# EasyEDA schematic EtapaDeControl.json
TITLE: Circuito de Control del Amplificador; REV: 1.0; Date: 2023-03-07; Sheet: 1/1; Company: UTP
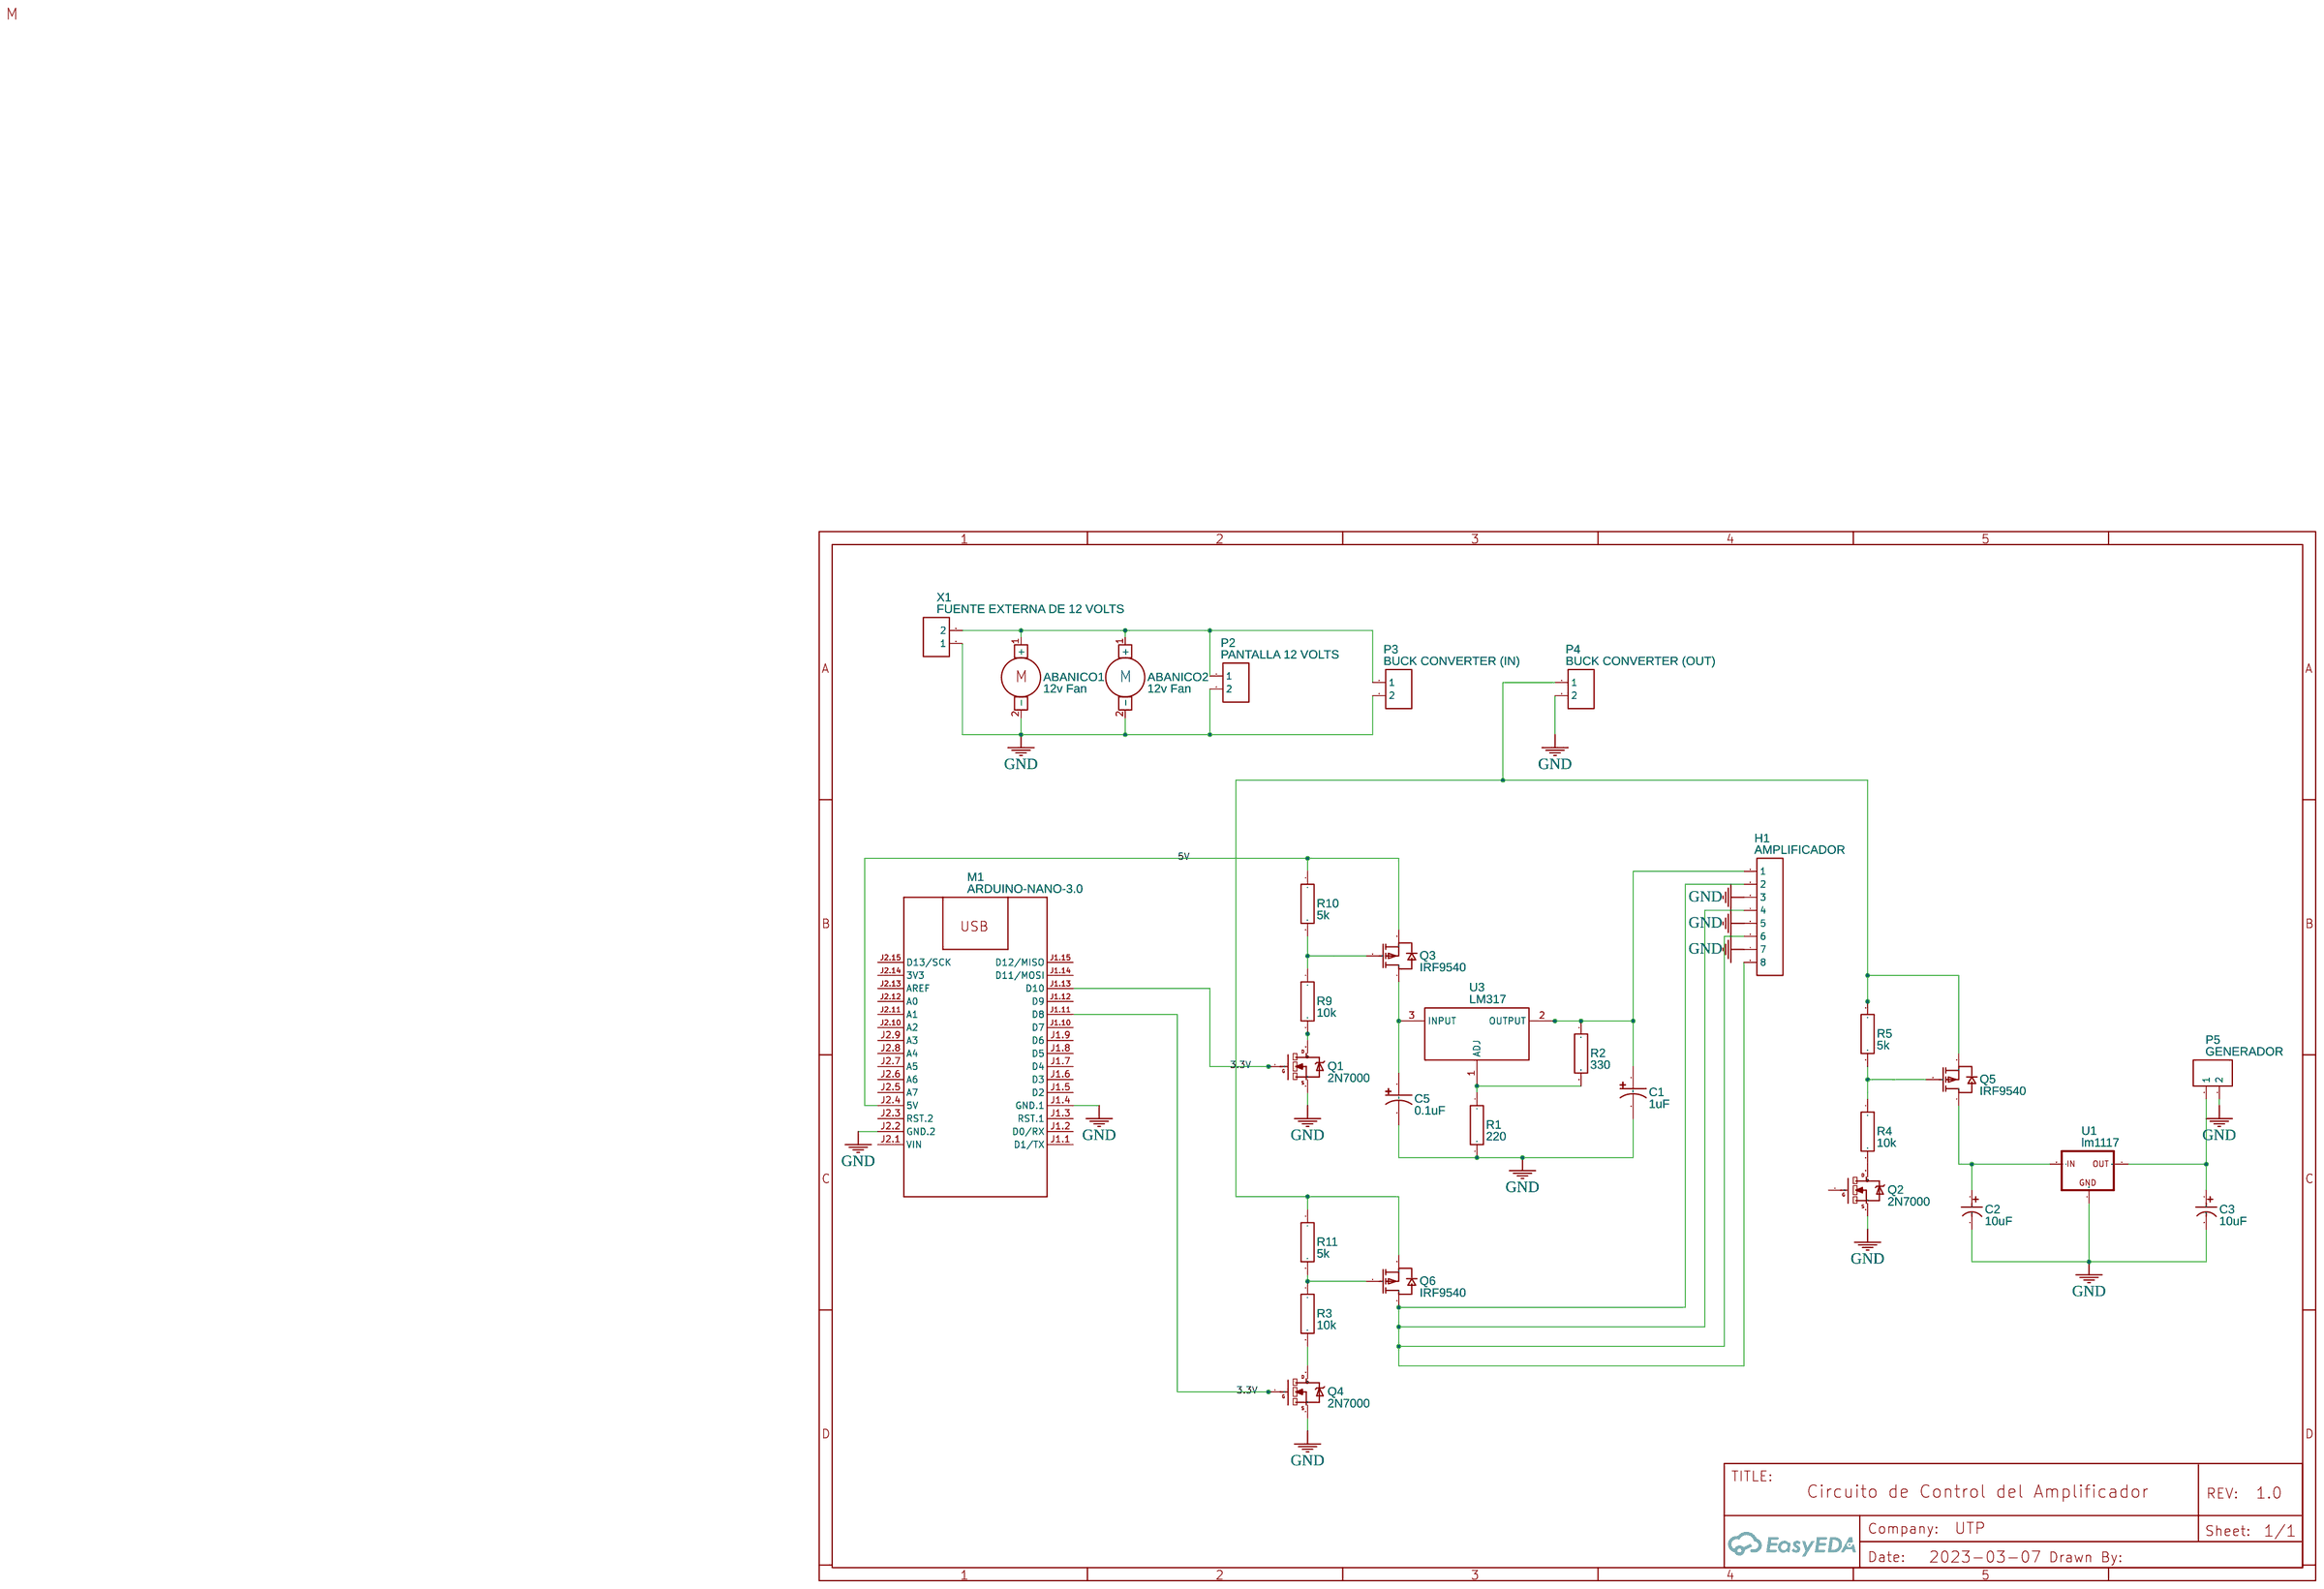
[diagram p0: schematic sheet]

## Parts
ABANICO1  12v Fan  [DC FAN]
ABANICO2  12v Fan  [DC FAN]
C1  1uF  [CAP-SMD_L3.2-W1.6]
C2  10uF  [CAP-SMD_BD4.0-L4.3-W4.3-FD]
C3  10uF  [CAP-SMD_BD4.0-L4.3-W4.3-FD]
C5  0.1uF  [CAP-SMD_L3.2-W1.6]
H1  AMPLIFICADOR  [HDR-F-2.54_1X8]
M1  ARDUINO-NANO-3.0  [ARDUINO-NANO-3.0]
P2  PANTALLA 12 VOLTS  [CONN-TH_2P-P5.00]
P3  BUCK CONVERTER (IN)  [CONN-TH_2P-P5.00]
P4  BUCK CONVERTER (OUT)  [CONN-TH_2P-P5.00]
P5  GENERADOR  [CONN-TH_2P-P5.00]
Q1  2N7000  [SOT23-3]
Q2  2N7000  [SOT23-3]
Q3  IRF9540  [TO-263-2_L10.0-W9.1-P5.08-LS15.2-BR]
Q4  2N7000  [SOT23-3]
Q5  IRF9540  [TO-263-2_L10.0-W9.1-P5.08-LS15.2-BR]
Q6  IRF9540  [TO-263-2_L10.0-W9.1-P5.08-LS15.2-BR]
R1  220  [RESISTOR-SMD]
R2  330  [RESISTOR-SMD]
R3  10k  [RESISTOR-SMD]
R4  10k  [RESISTOR-SMD]
R5  5k  [RESISTOR-SMD]
R9  10k  [RESISTOR-SMD]
R10  5k  [RESISTOR-SMD]
R11  5k  [RESISTOR-SMD]
U1  lm1117  [LM1117]
U3  LM317  [LM317DCY.]
X1  FUENTE EXTERNA DE 12 VOLTS  [CONN-TH_2P-P5.00]

## Library data of the parts
ABANICO1 ABANICO2 = 12v Fan: Contributor: kudgar
C1 C5 = 267M1602105KRA: Supplier: LCSC; Supplier Part: C231303; Manufacturer: Matsuo(松尾电机); Contributor: LCSC; JLCPCB Part Class: Extended Part
C2 C3 = 10UF: Supplier: LCSC; Supplier Part: C249759; Manufacturer: Lelon; Manufacturer Part: VEZ100M1E0405-TRO; Contributor: LCSC; LCSC Assembly: Yes; SMT Type: Extend
H1 = HDR-F-2.54_1x8: Supplier Part: C225505; Supplier: LCSC; Contributor: LCEDA_Lib
M1 = ARDUINO-NANO-3.0: Contributor: Tomasz Kuczyński
P2-P5 X1 = CONN-TH_2P-P5.00: Supplier: LCSC; Contributor: LCEDA_Lib
Q1 Q2 Q4 = MOSFET-NCHANNELSMD: Contributor: Arpit Pradhan
Q3 Q5 Q6 = IRF5210: Supplier: LCSC; Manufacturer: IR; image: //image.lceda.cn/szlcsc/C2622.jpg; Supplier Part: C2622; Paste Type: expand; Contributor: rahul8055
R1-R5 R9-R11 = 1,2k: Contributor: Vitaliy_Drozd
U1 = lm1117: Contributor: kleverfp
U3 = LM317: Manufacturer Part: Texas Instrument; Supplier Part: 296-23224-5-ND; Supplier: Digi-Key; link: https://easyeda.com/editor#id=364e3999b0554c309ff692a89169b61a|e1049ebff7364203986d8eded41812b1|_1ec5c8fb364145d695f32fca63cc5327|_3473fdf19c2c43b69786d7e4cec8776c|_ebef7e5d3f5b45b5b4bbfe52d2b3ed92|_78304fab4b104d07a1b98938696b1d68; Contributor: jopasmacarubbo

## Nets
3.3V: M1.J1.11(D8) M1.J1.13(D10) Q1.1(G) Q4.1(G)
5V: M1.J2.4(5V) Q3.3(S) R10.1
GND: ABANICO1.2(-) ABANICO2.2(-) C1.2 C2.2 C3.2 C5.2 H1.3 H1.5 H1.7 M1.J1.4(GND.1) M1.J2.2(GND.2) P2.2 P3.2 P4.2 P5.2 Q1.2(S) Q2.2(S) Q4.2(S) R1.2 U1.1(GND) X1.1
Net-(ABANICO1-1): ABANICO1.1(+) ABANICO2.1(+) P2.1 P3.1 X1.2
Net-(C1-1): C1.1 H1.1 R2.1 U3.2(OUTPUT)
Net-(C2-1): C2.1 Q5.4(D) U1.3(IN)
Net-(C3-1): C3.1 P5.1 U1.2(OUT)
Net-(C5-1): C5.1 Q3.4(D) U3.3(INPUT)
Net-(H1-2): H1.2 H1.4 H1.6 H1.8 Q6.4(D)
Net-(P4-1): P4.1 Q5.3(S) Q6.3(S) R5.1 R11.1
Net-(Q1-3): Q1.3(D) R9.2
Net-(Q2-3): Q2.3(D) R4.2
Net-(Q3-1): Q3.1(G) R9.1 R10.2
Net-(Q4-3): Q4.3(D) R3.2
Net-(Q5-1): Q5.1(G) R4.1 R5.2
Net-(Q6-1): Q6.1(G) R3.1 R11.2
Net-(R1-1): R1.1 R2.2 U3.1(ADJ)

Not connected (* = marked no-connect by the designer): M1 J1.1(D1/TX) J1.2(D0/RX) J1.3(RST.1) J1.5(D2) J1.6(D3) J1.7(D4) J1.8(D5) J1.9(D6) J1.10(D7) J1.12(D9) J1.14(D11/MOSI) J1.15(D12/MISO) J2.1(VIN) J2.3(RST.2) J2.5(A7) J2.6(A6) J2.7(A5) J2.8(A4) J2.9(A3) J2.10(A2) J2.11(A1) J2.12(A0) J2.13(AREF) J2.14(3V3) J2.15(D13/SCK); Q2 1(G)

## Notes on the sheet
- M
